# EAGLE design gameboy-macro (EAGLE 8.4.1)
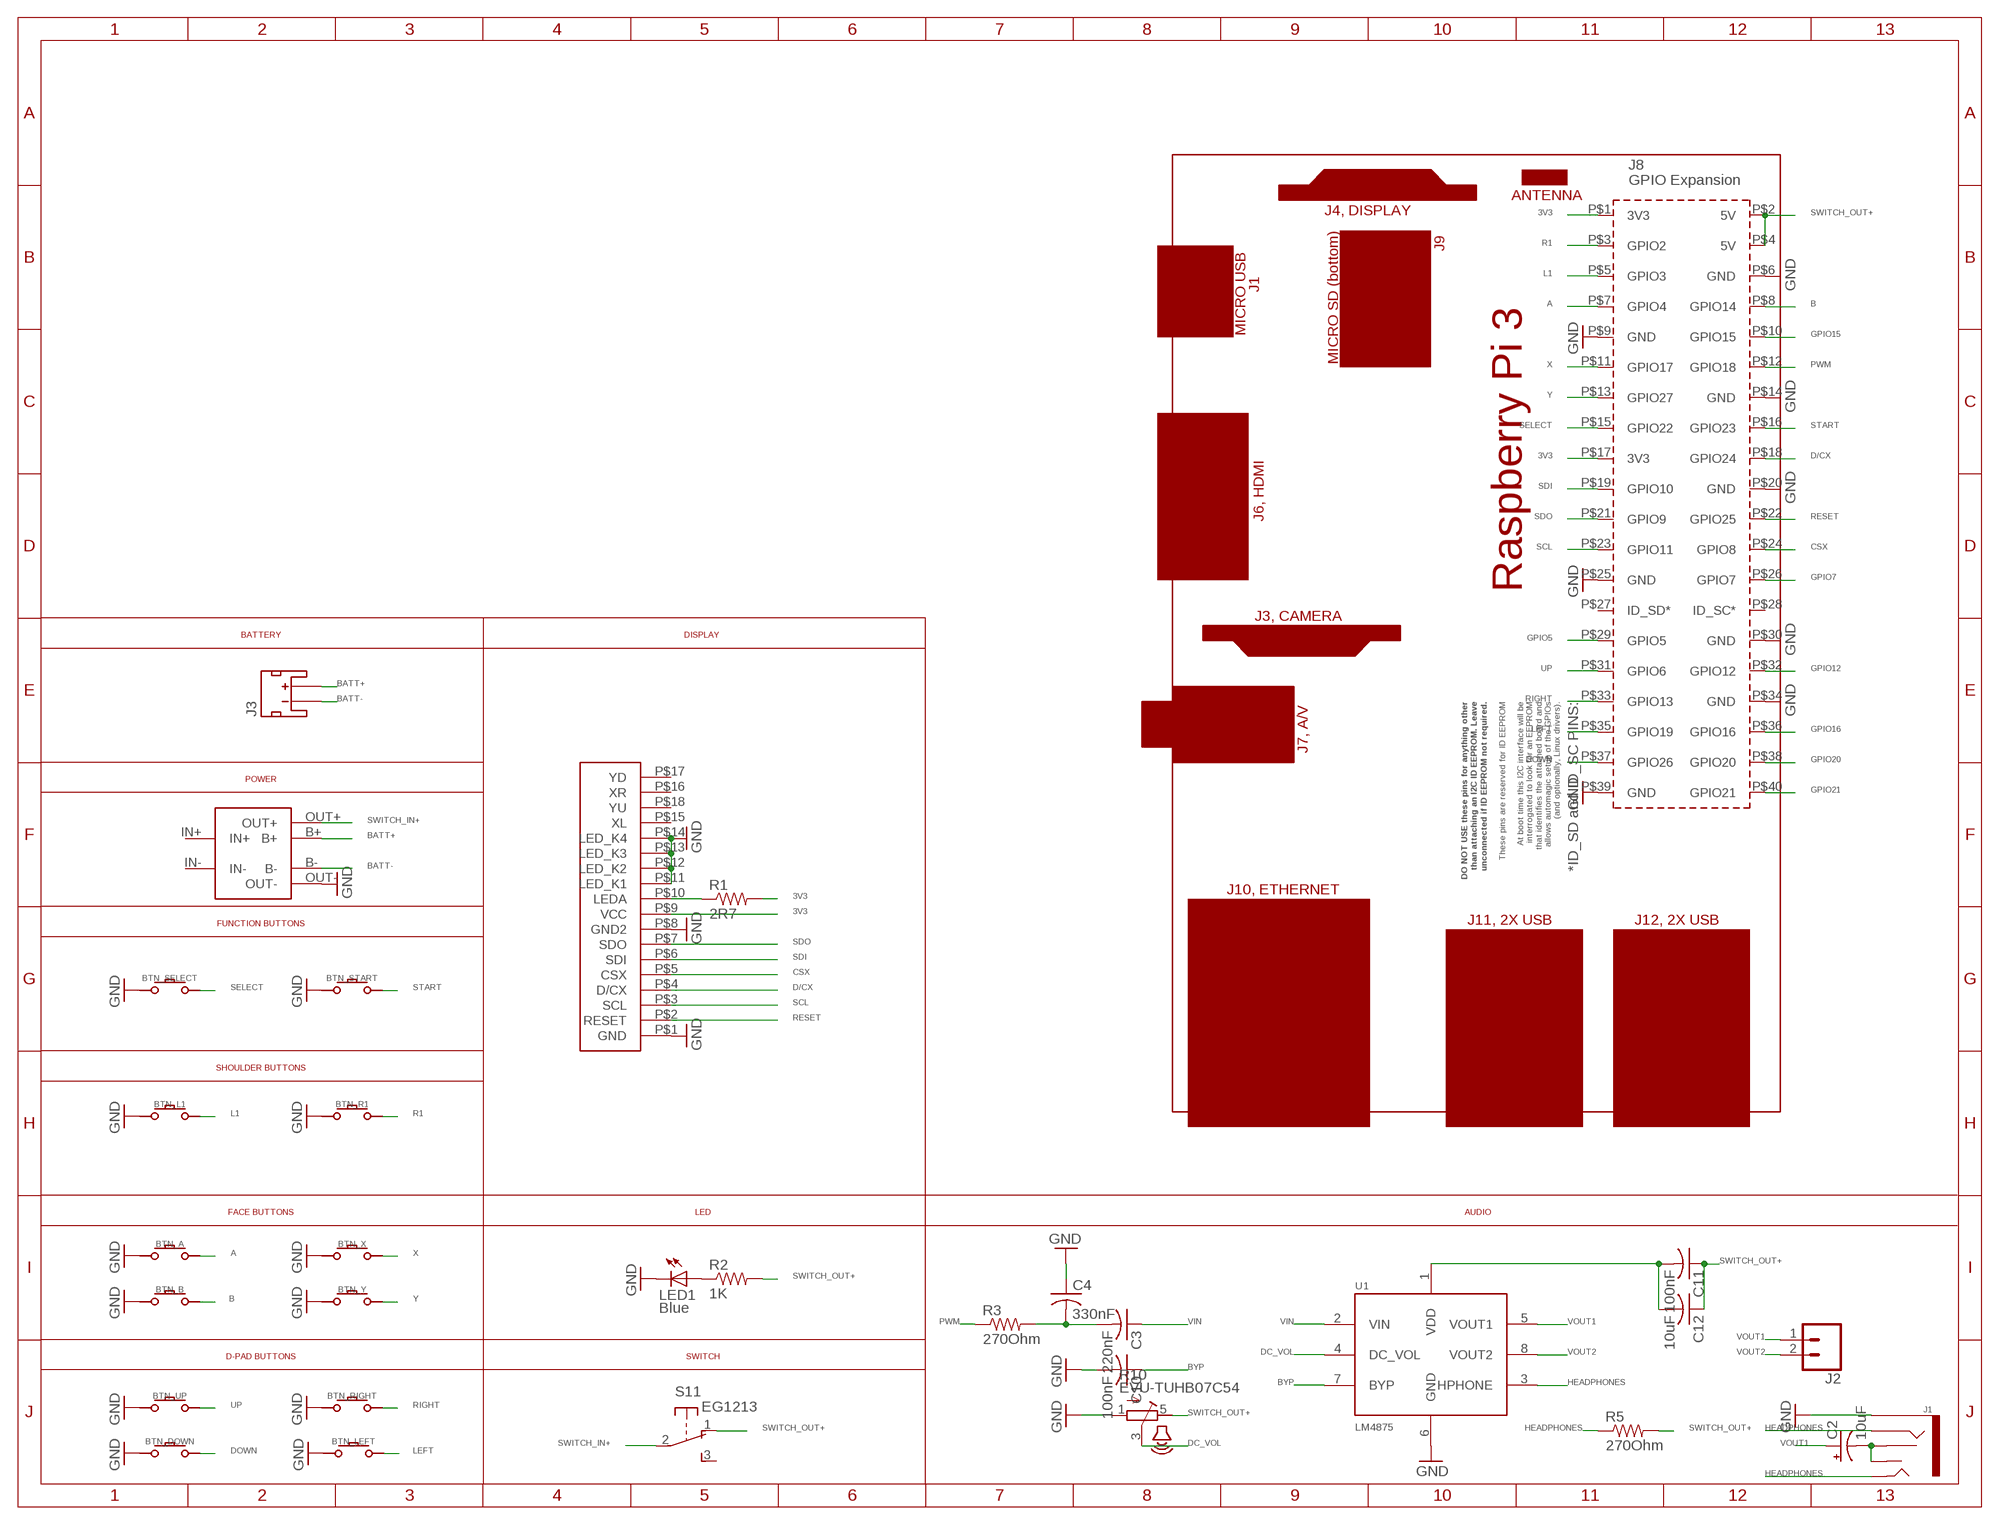
[diagram p0: schematic, sheet 1]

## Parts
BTN_A  GAMEBOY-ZERO-BUTTON  [GAMEBOY-ZERO-BUTTON]
BTN_B  GAMEBOY-ZERO-BUTTON  [GAMEBOY-ZERO-BUTTON]
BTN_DOWN  GAMEBOY-ZERO-BUTTON  [GAMEBOY-ZERO-BUTTON]
BTN_L1  GAMEBOY-ZERO-BUTTON  [GAMEBOY-ZERO-BUTTON]
BTN_LEFT  GAMEBOY-ZERO-BUTTON  [GAMEBOY-ZERO-BUTTON]
BTN_R1  GAMEBOY-ZERO-BUTTON  [GAMEBOY-ZERO-BUTTON]
BTN_RIGHT  GAMEBOY-ZERO-BUTTON  [GAMEBOY-ZERO-BUTTON]
BTN_SELECT  GAMEBOY-ZERO-BUTTON  [GAMEBOY-ZERO-BUTTON]
BTN_START  GAMEBOY-ZERO-BUTTON  [GAMEBOY-ZERO-BUTTON]
BTN_UP  GAMEBOY-ZERO-BUTTON  [GAMEBOY-ZERO-BUTTON]
BTN_X  GAMEBOY-ZERO-BUTTON  [GAMEBOY-ZERO-BUTTON]
BTN_Y  GAMEBOY-ZERO-BUTTON  [GAMEBOY-ZERO-BUTTON]
C2  10uF  10UF-POLAR-EIA3216-16V-10%(TANT)  [EIA3216]
C3  220nF  C-USC0805  [C0805]
C4  330nF  C-USC0805  [C0805]
C10  100nF  C-USC0805  [C0805]
C11  100nF  C-USC0805  [C0805]
C12  10uF  C-USC0805  [C0805]
ILI9341-TFT-2.8  GAMEBOYZEROHANDHELDDISPLAYS-3.2  [GAMEBOYZEROHANDHELDDISPLAYS-3.2]
J1  AUDIO_JACK_3.5MM_PTH  [AUDIO-JACK]
J2  CONN_02  [1X02]
J3  JST_2MM_MALE  [JST-2-SMD]
LED1  Blue  LEDCHIPLED_0805  [CHIPLED_0805]
PCB1  RPI3RPI3  [RPI3]
POWER1  03962A  [03962A]
R1  2R7  R-US_R0805  [R0805]
R2  1K  R-US_R0805  [R0805]
R3  270Ohm  R-US_R0805  [R0805]
R5  270Ohm  R-US_R0805  [R0805]
R10  EVU-TUHB07C54  VOLUME  [VOLUME]
S1  EG1213  [EG1213]
U1  LM4875  [SOIC8]

## Nets
3V3: ILI9341-TFT-2.8.P$9(VCC) PCB1.P$1(3V3) PCB1.P$17(3V3) R1.2
3V3100OHM: ILI9341-TFT-2.8.P$10(LEDA) R1.1
A: BTN_A.P$ACTIVE PCB1.P$7(GPIO4)
B: BTN_B.P$ACTIVE PCB1.P$8(GPIO14)
BATT+: J3.2(+) POWER1.B+
BATT-: J3.1(-) POWER1.B-
BYP: C10.1 U1.7(BYP)
CAP_LINE: C11.2 C12.2 U1.1(VDD)
CAP_LINE_JACK: C2.- J1.RSH J1.TSH
CSX: ILI9341-TFT-2.8.P$5(CSX) PCB1.P$24(GPIO8)
D/CX: ILI9341-TFT-2.8.P$4(D/CX) PCB1.P$18(GPIO24)
DC_VOL: R10.3(S) U1.4(DC_VOL)
DOWN: BTN_DOWN.P$ACTIVE PCB1.P$37(GPIO26)
GND: BTN_A.P$GND BTN_B.P$GND BTN_DOWN.P$GND BTN_L1.P$GND BTN_LEFT.P$GND BTN_R1.P$GND BTN_RIGHT.P$GND BTN_SELECT.P$GND BTN_START.P$GND BTN_UP.P$GND BTN_X.P$GND BTN_Y.P$GND C4.1 C10.2 ILI9341-TFT-2.8.P$1(GND) ILI9341-TFT-2.8.P$8(GND2) ILI9341-TFT-2.8.P$11(LED_K1) ILI9341-TFT-2.8.P$12(LED_K2) ILI9341-TFT-2.8.P$13(LED_K3) ILI9341-TFT-2.8.P$14(LED_K4) J1.SLEEVE LED1.C PCB1.P$6(GND) PCB1.P$9(GND) PCB1.P$14(GND) PCB1.P$20(GND) PCB1.P$25(GND) PCB1.P$30(GND) PCB1.P$34(GND) PCB1.P$39(GND) POWER1.OUT- R10.1(A) U1.6(GND)
GPIO5: PCB1.P$29(GPIO5)
GPIO7: PCB1.P$26(GPIO7)
GPIO12: PCB1.P$32(GPIO12)
GPIO15: PCB1.P$10(GPIO15)
GPIO16: PCB1.P$36(GPIO16)
GPIO20: PCB1.P$38(GPIO20)
GPIO21: PCB1.P$40(GPIO21)
HEADPHONES: J1.RING J1.TIP R5.1 U1.3(HPHONE)
L1: BTN_L1.P$ACTIVE PCB1.P$5(GPIO3)
LED: LED1.A R2.1
LEFT: BTN_LEFT.P$ACTIVE PCB1.P$35(GPIO19)
N$2: C3.2 C4.2 R3.2
PWM: PCB1.P$12(GPIO18) R3.1
R1: BTN_R1.P$ACTIVE PCB1.P$3(GPIO2)
RESET: ILI9341-TFT-2.8.P$2(RESET) PCB1.P$22(GPIO25)
RIGHT: BTN_RIGHT.P$ACTIVE PCB1.P$33(GPIO13)
SCL: ILI9341-TFT-2.8.P$3(SCL) PCB1.P$23(GPIO11)
SDI: ILI9341-TFT-2.8.P$6(SDI) PCB1.P$19(GPIO10)
SDO: ILI9341-TFT-2.8.P$7(SDO) PCB1.P$21(GPIO9)
SELECT: BTN_SELECT.P$ACTIVE PCB1.P$15(GPIO22)
START: BTN_START.P$ACTIVE PCB1.P$16(GPIO23)
SWITCH_IN+: POWER1.OUT+ S1.2(1:P)
SWITCH_OUT+: C11.1 C12.1 PCB1.P$2(5V) PCB1.P$4(5V) R2.2 R5.2 R10.5(E) S1.1(1:O)
UP: BTN_UP.P$ACTIVE PCB1.P$31(GPIO6)
VIN: C3.1 U1.2(VIN)
VOUT1: C2.+ J2.1 U1.5(VOUT1)
VOUT2: J2.2 U1.8(VOUT2)
X: BTN_X.P$ACTIVE PCB1.P$11(GPIO17)
Y: BTN_Y.P$ACTIVE PCB1.P$13(GPIO27)
Unconnected: ILI9341-TFT-2.8.P$15(XL) ILI9341-TFT-2.8.P$16(XR) ILI9341-TFT-2.8.P$17(YD) ILI9341-TFT-2.8.P$18(YU) J3.NC1(PAD1) J3.NC2(PAD2) PCB1.P$27(ID_SD*) PCB1.P$28(ID_SC*) POWER1.IN+ POWER1.IN- S1.3(1:S) S1.MT1(MT) S1.MT2(MT)

## Notes on the sheet
- BATTERY | DISPLAY
- POWER
- FUNCTION BUTTONS
- SHOULDER BUTTONS
- FACE BUTTONS | LED | AUDIO
- D-PAD BUTTONS | SWITCH

## Library data of the parts
BTN_A BTN_B BTN_DOWN BTN_L1 BTN_LEFT BTN_R1 BTN_RIGHT BTN_SELECT BTN_START BTN_UP BTN_X BTN_Y = GameboyZeroButtonLibrary:GAMEBOY-ZERO-BUTTON
C2 = SparkFun-Capacitors:10UF-POLAR: 10.0µF polarized capacitors A capacitor is a passive two-terminal electrical component used to store electrical energy temporarily in an electric field.; PROD_ID: CAP-00811
C3 C4 C10-C12 = adafruit:C-US: CAPACITOR, American symbol
ILI9341-TFT-2.8 = GameboyZeroHandheldDisplays:GAMEBOYZEROHANDHELDDISPLAYS-3.2
J1 = SparkFun-Connectors:AUDIO_JACK_3.5MM: Audio Jack 3.5mm variants of PTH and SMT stereo audio jack with bypass switches. SparkFun Products: SparkFun SparkPunk Sound Kit <[https://www.sparkfun.com/products/11177]> - PTH MP3 Trigger <https://www.sparkfun.com/products/13720> -3.5mm SMD SparkFun PicoBoard <https://www.sparkfun.com/products/11888>- 2.5mm SMD; PROD_ID: CONN-08774; SF_ID: PRT-08032
J2 = SparkFun-Connectors:CONN_02: Multi connection point. Often used as Generic Header-pin footprint for 0.1 inch spaced/style header connections On any of the 0.1 inch spaced packages, you can populate with these: Break Away Headers - Straight <https://www.sparkfun.com/products/116> (PRT-00116) Break Away Male Headers - Right Angle <https://www.sparkfun.com/products/553> (PRT-00553) Female Headers <https://www.sparkfun.com/products/115> (PRT-00115) Break Away Headers - Machine Pin <https://www.sparkfun.com/products/117> (PRT-00117) Break Away Female Headers - Swiss Machine Pin <https://www.sparkfun.com/products/743> (PRT-00743) For SCREWTERMINALS and SPRING TERMINALS visit here: Screw Terimnals on SparkFun.com <https://www.sparkfun.com/search/results?term=Screw+Terminals> (5mm/3.5mm/2.54mm spacing) This device is also useful as a general connection point to wire up your design to another part of your project. Our various solder wires solder well into these plated through hole pads. Hook-Up Wire - Assortment (Stranded, 22 AWG) <https://www.sparkfun.com/products/11375> (PRT-11375) Hook-Up Wire - Assortment (Solid Core, 22 AWG) <https://www.sparkfun.com/products/11367> (PRT-11367) View the entire wire category on our website here <https://www.sparkfun.com/categories/141> Special notes: Molex polarized connector foot print use with: PRT-08233 with associated crimp pins and housings. 2.54_SCREWTERM for use with PRT-10571. 3.5mm Screw Terminal footprints for PRT-08084 5mm Screw Terminal footprints for use with PRT-08432
J3 = SparkFun-Connectors:JST_2MM_MALE: Mates to single-cell LiPo batteries. CONN-11443 Now with smashable polarity marks!; BTM_NEG: -; BTM_POS: +; PROD_ID: CONN-11443; TOP_NEG: -; TOP_POS: +
LED1 = adafruit:LED: LED OSRAM: - CHIPLED LG R971, LG N971, LY N971, LG Q971, LY Q971, LO R971, LY R971 LH N974, LH R974 LS Q976, LO Q976, LY Q976 LO Q996 - Hyper CHIPLED LW Q18S LB Q993, LB Q99A, LB R99A - SideLED LS A670, LO A670, LY A670, LG A670, LP A670 LB A673, LV A673, LT A673, LW A673 LH A674 LY A675 LS A676, LA A676, LO A676, LY A676, LW A676 LS A679, LY A679, LG A679 - Hyper Micro SIDELED® LS Y876, LA Y876, LO Y876, LY Y876 LT Y87S - SmartLED LW L88C, LW L88S LB L89C, LB L89S, LG L890 LS L89K, LO L89K, LY L89K LS L896, LA L896, LO L896, LY L896 - TOPLED LS T670, LO T670, LY T670, LG T670, LP T670 LSG T670, LSP T670, LSY T670, LOP T670, LYG T670 LG T671, LOG T671, LSG T671 LB T673, LV T673, LT T673, LW T673 LH T674 LS T676, LA T676, LO T676, LY T676, LB T676, LH T676, LSB T676, LW T676 LB T67C, LV T67C, LT T67C, LS T67K, LO T67K, LY T67K, LW E67C LS E67B, LA E67B, LO E67B, LY E67B, LB E67C, LV E67C, LT E67C LW T67C LS T679, LY T679, LG T679 LS T770, LO T770, LY T770, LG T770, LP T770 LB T773, LV T773, LT T773, LW T773 LH T774 LS E675, LA E675, LY E675, LS T675 LS T776, LA T776, LO T776, LY T776, LB T776 LHGB T686 LT T68C, LB T68C - Hyper Mini TOPLED® LB M676 - Mini TOPLED Santana® LG M470 LS M47K, LO M47K, LY M47K Source: http://www.osram.convergy.de/
PCB1 = e14_Rpi3_RevA+mirror-pcb-no-silk:RPI3: Device for Raspberry Pi 3 board created by Dave Young for www.element14.com More information and support community is available at https://www.element14.com/community/community/raspberry-pi Device for Raspberry Pi 3 board updated by Gerald Schwarz for www.element14.com On RPI3 addet the layer milling and created a mirrored shield.
POWER1 = 03962A:03962A
R1-R3 R5 = adafruit:R-US_: RESISTOR, American symbol
R10 = GBA:VOLUME
S1 = adafruit:EG1213: E-Switch right-angle slide SPDT Part #EG1213 http://www.ladyada.net/library/eagle
U1 = texas:LM4875

## Board
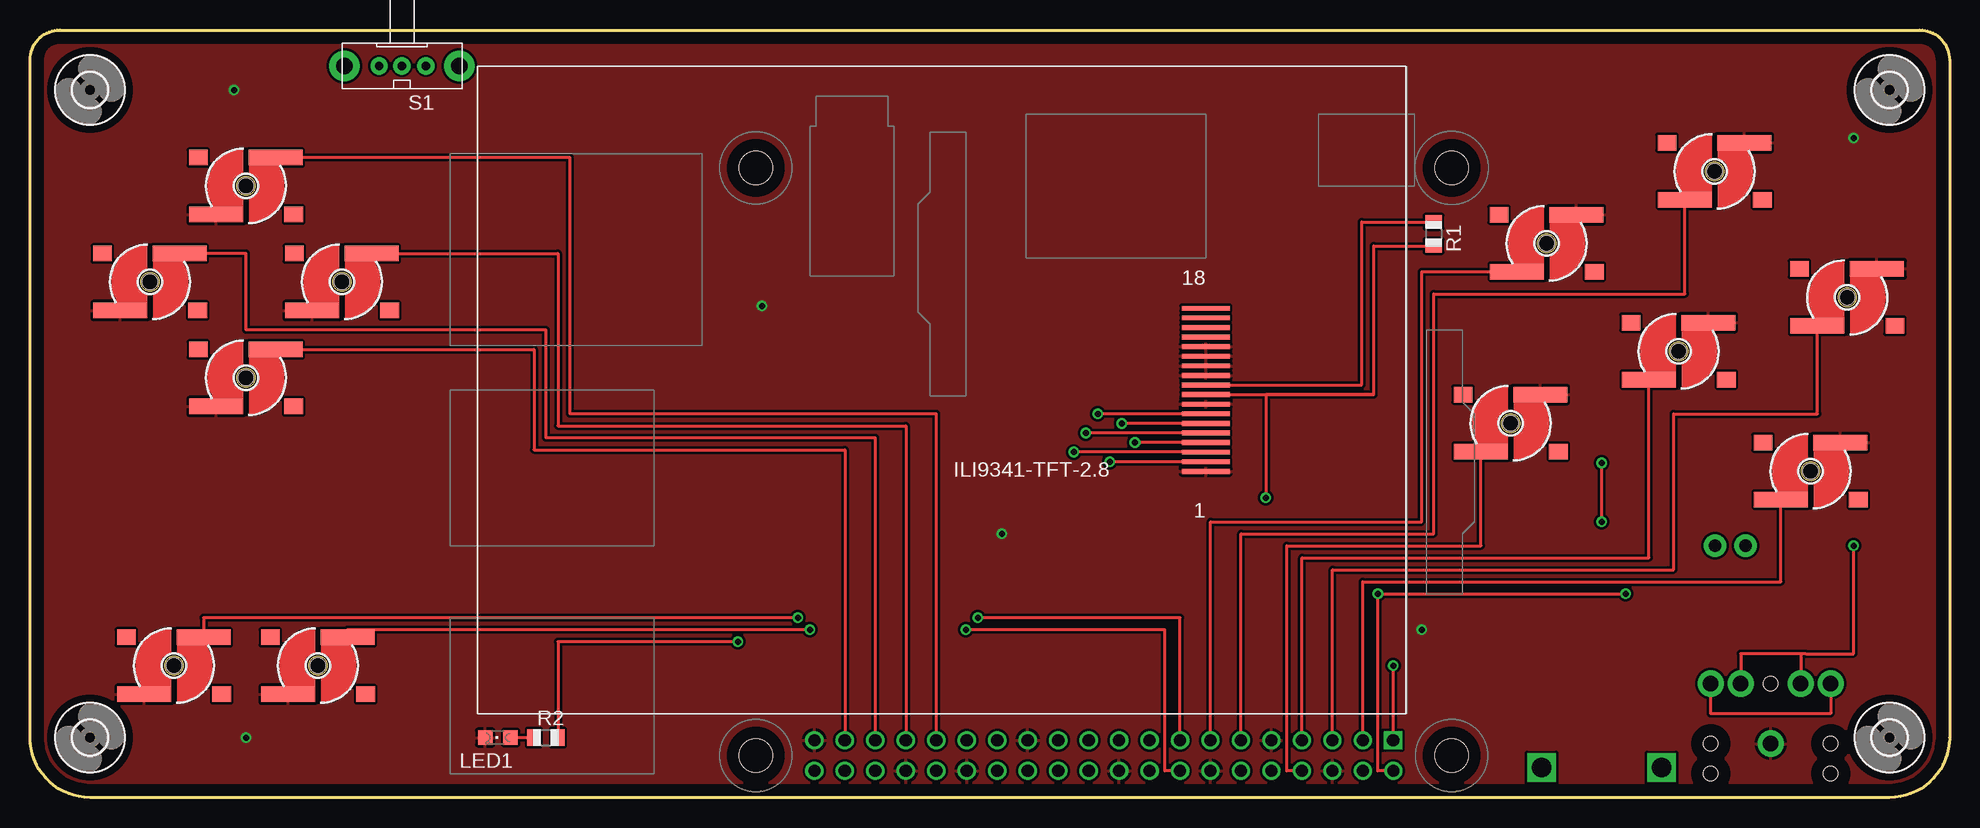
[diagram p1: board, top side]
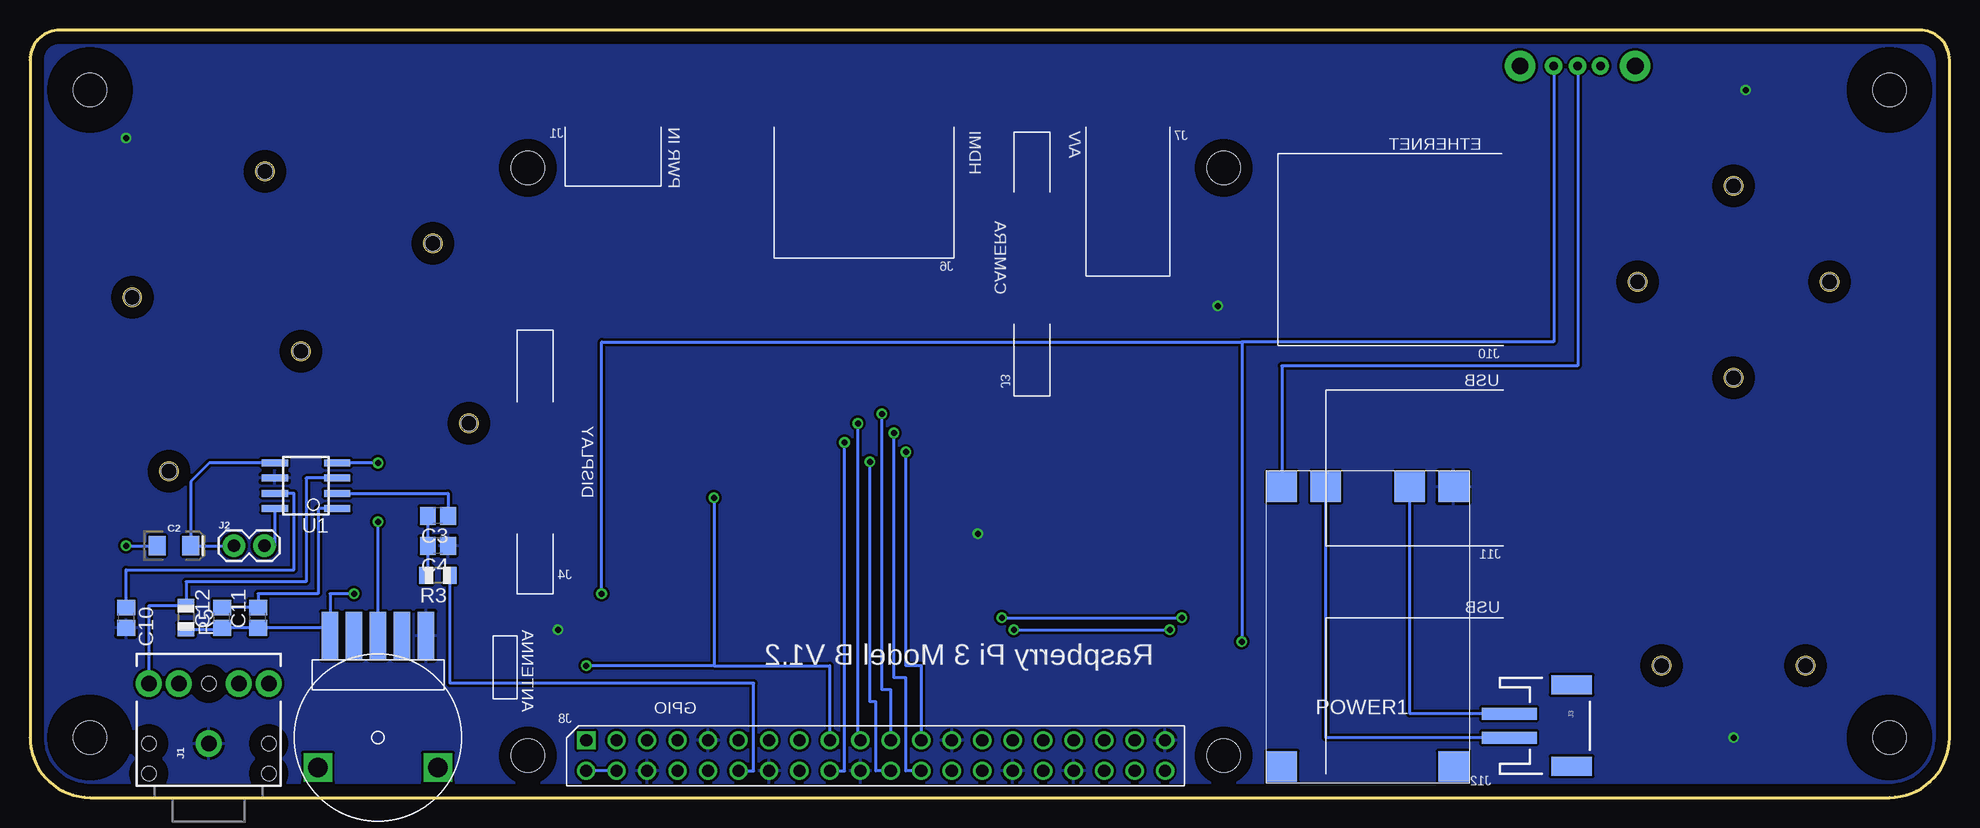
[diagram p2: board, bottom side, seen from below]

Size 160 x 64 mm. Coordinates in mm from the lower left corner, seen from the top.
Outline: 160,61.5 160,5 arc-90 155,0 5,0 arc-90 0,5 0,61.5 arc-90 2.5,64 157.5,64 arc-90 160,61.5
Copper layers (1*16): Top 0.035mm / dielectric 1.5mm / Bottom 0.035mm
Design rules "default": minimum track width 10mil, minimum drill 24mil, track to track 8mil, track to pad 8mil, pad to pad 8mil, via to via 8mil, smd to smd 8mil, copper to edge 40mil, drill to drill 8mil, minimum pad ring 10mil, minimum via ring 8mil, stop-mask expansion 4mil, vias tented up to drill 0mil, thermal gap 10mil

### Footprints (pad centres in the part's own frame; a part is rotated, then mirrored left to right if it is on the bottom)
GAMEBOY-ZERO-BUTTON = smd 4.5 x 1.3: P$ACTIVE 2.475,2.365; P$GND -2.475,-2.385 | smd 1.55 x 1.3: P$NC -3.975,2.365; P$NC2 3.975,-2.385 | hole 1.25: 0,0
EIA3216 = smd 1.4 x 1.6: + 1.4,0; - -1.4,0
C0805 = smd 1.3 x 1.5: 1 -0.85,0; 2 0.85,0
GAMEBOYZEROHANDHELDDISPLAYS-3.2 = smd 4 x 0.4: P$1 -22,6.8; P$2 -22,6; P$3 -22,5.2; P$4 -22,4.4; P$5 -22,3.6; P$6 -22,2.8; P$7 -22,2; P$8 -22,1.2; P$9 -22,0.4; P$10 -22,-0.4; P$11 -22,-1.2; P$12 -22,-2; P$13 -22,-2.8; P$14 -22,-3.6; P$15 -22,-4.4; P$16 -22,-5.2; P$17 -22,-6; P$18 -22,-6.8
AUDIO-JACK = drill 1.3 pad 2.184: RING 5,5; RSH 5,2.5; SLEEVE 0,0; TIP 5,-5; TSH 5,-2.5 | hole 1.2: 0,5; -2.5,5; -2.5,-5; 0,-5; 5,0
1X02 = drill 1.016 pad 1.88: 1 0,0; 2 2.54,0
JST-2-SMD = smd 1 x 4.6: 1 -1,-3.7; 2 1,-3.7 | smd 1.6 x 3.4: NC1 -3.4,1.5; NC2 3.4,1.5
CHIPLED_0805 = smd 1.2 x 1.2: A 0,-1.05; C 0,1.05
RPI3 = drill 1.016 square: P$1 8.37,51.23 | drill 1.016: P$2 8.357,53.772; P$3 10.897,51.232; P$4 10.897,53.772; P$5 13.437,51.232; P$6 13.437,53.772; P$7 15.977,51.232; P$8 15.977,53.772; P$9 18.517,51.232; P$10 18.517,53.772; P$11 21.057,51.232; P$12 21.057,53.772; P$13 23.597,51.232; P$14 23.597,53.772; P$15 26.137,51.232; P$16 26.137,53.772; P$17 28.677,51.232; P$18 28.677,53.772; P$19 31.217,51.232; P$20 31.217,53.772; P$21 33.757,51.232; P$22 33.757,53.772; P$23 36.297,51.232; P$24 36.297,53.772; P$25 38.837,51.232; P$26 38.837,53.772; P$27 41.377,51.232; P$28 41.377,53.772; P$29 43.917,51.232; P$30 43.917,53.772; P$31 46.457,51.232; P$32 46.457,53.772; P$33 48.997,51.232; P$34 48.997,53.772; P$35 51.537,51.232; P$36 51.537,53.772; P$37 54.077,51.232; P$38 54.077,53.772; P$39 56.617,51.232; P$40 56.617,53.772 | hole 2.75: 3.5,3.5; 61.5,3.5; 3.5,52.5; 61.5,52.5
03962A = smd 2.54 x 2.54: B+ 12,1.35; B- 5,1.35; IN+ 15.65,24.65; IN- 1.35,24.65; OUT+ 15.65,1.35; OUT- 1.35,1.35
R0805 = smd 1.1 x 1.4: 1 -1,0; 2 1,0
VOLUME = smd 1.4 x 4: 1 -4,-2; 2 -2,-2; 3 0,-2; 4 2,-2; 5 4,-2 | drill 1.6 square: P$6 -5,9; P$7 5,9
EG1213 = drill 0.7 pad 1.422: 1 -2,0; 2 0,0; 3 1.9,0 | drill 1.4 pad 2.54: MT1 -4.8,0; MT2 4.8,0
SOIC8 = smd 0.6 x 2.2: 1 -1.905,-2.6; 2 -0.635,-2.6; 3 0.635,-2.6; 4 1.905,-2.6; 5 1.905,2.6; 6 0.635,2.6; 7 -0.635,2.6; 8 -1.905,2.6
2,8 = hole 2.8: 0,0

### Placement (x,y rotation side)
BTN_A  137.42,37.21 180 top
BTN_B  123.42,31.21 180 top
BTN_DOWN  18,35 0 top
BTN_L1  151.47,41.7 180 top
BTN_LEFT  10,43 0 top
BTN_R1  148.42,27.21 180 top
BTN_RIGHT  26,43 0 top
BTN_SELECT  12,11 0 top
BTN_START  24,11 0 top
BTN_UP  18,51 0 top
BTN_X  140.42,52.21 180 top
BTN_Y  126.42,46.21 180 top
C2  148,21 0 bottom
C3  126,23.5 180 bottom
C4  126,21 180 bottom
C10  152,15 270 bottom
C11  141,15 90 bottom
C12  144,15 90 bottom
ILI9341-TFT-2.8  76,34 180 top
J1  145.1,4.5 90 bottom
J2  143,21 0 bottom
J3  33,6 270 bottom
LED1  39,5 90 top
PCB1  122,56 180 top
POWER1  40,27.25 180 bottom
R1  117,47 270 top
R2  43,5 0 top
R3  126,18.52 180 bottom
R5  147,15 270 bottom
R10  131,11.5 180 bottom
S1  31,61 180 top
U1  137,26 90 bottom
U$4  [2,8]  5,59 0 top
U$5  [2,8]  155,59 0 top
U$6  [2,8]  155,5 0 top
U$7  [2,8]  5,5 0 top

### Tracks (layer width: path | path; a pad name or v marks a point on that pad's centre or on a via)
3V3  (via drill 0.5)
  Top 0.254: ILI9341-TFT-2.8.P$9 112,33.6 | 112,33.6 112,46 R1.2 | PCB1.P$1 v113.63,11 | 112,33.6 103,33.6 v103,25
  Bottom 0.254: PCB1.P$17 93.32,11 103,11 | 103,11 v113.63,11 | v103,25 103,11
3V3100OHM
  Top 0.254: ILI9341-TFT-2.8.P$10 111,34.4 111,48 R1.1
A
  Top 0.254: PCB1.P$7 106.02,20 134.94,20 BTN_A.P$ACTIVE
B
  Top 0.254: PCB1.P$8 104.75,2.23 104.75,21 120.94,21 BTN_B.P$ACTIVE
BATT+
  Bottom 0.254: J3.2 52,5 POWER1.B+
BATT-
  Bottom 0.254: J3.1 45,7 POWER1.B-
BYP
  Bottom 0.254: C10.1 152,19 138,19 138,25.36 U1.7
CAP_LINE
  Bottom 0.254: C12.2 C11.2 141,17 136,17 136,24.09 U1.1
CAP_LINE_JACK  (via drill 0.5)
  Top 0.254: 148,12 147.6,12 J1.RSH | 148,12 152,12 v152,21 | 148,12 142.6,12 J1.TSH
  Bottom 0.254: v152,21 C2.-
CSX  (via drill 0.5)
  Top 0.254: ILI9341-TFT-2.8.P$5 v88,30.4
  Bottom 0.254: v88,30.4 88,10 87,10 87,2.23 PCB1.P$24
D/CX  (via drill 0.5)
  Top 0.254: ILI9341-TFT-2.8.P$4 v92.1,29.6
  Bottom 0.254: PCB1.P$18 92.1,2.23 v92.1,29.6
DC_VOL  (via drill 0.5)
  Top 0.254: v131,23 v131,27.91
  Bottom 0.254: v131,27.91 U1.4 | R10.3 v131,23
DOWN
  Top 0.254: PCB1.P$37 67.92,29 42,29 42,37.37 BTN_DOWN.P$ACTIVE
GND  (via drill 0.5)
  other vias: 17,59 61,41 81,22 152,55 116,14 18,5
  pour Top: 160,61.5 160,5 arc-90 155,0 5,0 arc-90 0,5 0,61.5 arc-90 2.5,64 157.5,64 arc-90
  pour Bottom: 0,61.5 0,5 arc90 5,0 155,0 arc90 160,5 160,61.5 arc90 157.5,64 2.5,64 arc90
HEADPHONES
  Top 0.254: J1.TIP 140.1,7 150.1,7 J1.RING
  Bottom 0.254: U1.3 137,26.64 137,18 147,18 R5.1 150.1,16 J1.RING
L1
  Top 0.254: PCB1.P$5 108.56,19 137,19 137,32 149,32 BTN_L1.P$ACTIVE
LED
  Top 0.254: R2.1 LED1.A
LEFT
  Top 0.254: PCB1.P$35 70.46,30 43,30 43,39 18,39 18,45.37 BTN_LEFT.P$ACTIVE
N$2
  Bottom 0.254: C3.2 C4.2 126.85,18.52 R3.2
PWM
  Bottom 0.254: PCB1.P$12 99.67,2.23 99.67,9.53 125,9.53 R3.1
R1
  Top 0.254: PCB1.P$3 111.1,18 145.94,18 BTN_R1.P$ACTIVE
RESET  (via drill 0.5)
  Top 0.254: ILI9341-TFT-2.8.P$2 v90,28
  Bottom 0.254: PCB1.P$22 89.5,2.23 89.5,8 90,8 v90,28
RIGHT
  Top 0.254: PCB1.P$33 73,31 44,31 44,45.37 BTN_RIGHT.P$ACTIVE
SCL  (via drill 0.5)
  Top 0.254: ILI9341-TFT-2.8.P$3 v87,28.8
  Bottom 0.254: v87,28.8 87,11 85.7,11 PCB1.P$23
SDI  (via drill 0.5)
  Top 0.254: ILI9341-TFT-2.8.P$6 v91,31.2
  Bottom 0.254: PCB1.P$19 91,4.77 v91,31.2
SDO  (via drill 0.5)
  Top 0.254: ILI9341-TFT-2.8.P$7 v89,32
  Bottom 0.254: v89,32 89,9 88.24,9 PCB1.P$21
SELECT  (via drill 0.5)
  Top 0.254: PCB1.P$15 95.86,15 v79,15 | v64,15 14.47,15 BTN_SELECT.P$ACTIVE
  Bottom 0.254: v79,15 v64,15
START  (via drill 0.5)
  Top 0.254: PCB1.P$16 94.6,2.23 94.6,14 v78,14 | v65,14 26.48,14 BTN_START.P$ACTIVE
  Bottom 0.254: v78,14 v65,14
SWITCH_IN+
  Bottom 0.254: S1.2 31,36 55.65,36 POWER1.OUT+
SWITCH_OUT+  (via drill 0.5)
  Top 0.254: PCB1.P$2 112.35,2.23 v112.35,17 v133,17 | v59,13 44,13 R2.2
  Bottom 0.254: R5.2 144,14 C12.1 C11.1 135,14.15 | PCB1.P$4 PCB1.P$2 | S1.1 33,38 59,38 | v133,17 135,17 135,14.15 | 135,14.15 R10.5 | v112.35,17 112.35,38 59,38 | 59,38 v59,13
UP
  Top 0.254: PCB1.P$31 75.54,32 45,32 45,53.37 BTN_UP.P$ACTIVE
VIN
  Bottom 0.254: U1.2 125.15,25.36 C3.1
VOUT1
  Bottom 0.254: J2.1 C2.+ 146.6,26.35 145.05,27.91 U1.5
VOUT2
  Bottom 0.254: U1.8 139.6,21 J2.2
X
  Top 0.254: PCB1.P$11 100.94,22 117,22 117,42 137.94,42 BTN_X.P$ACTIVE
Y
  Top 0.254: PCB1.P$13 98.4,23 116,23 116,43.84 BTN_Y.P$ACTIVE